# EAGLE design mega128board (EAGLE 6.1)
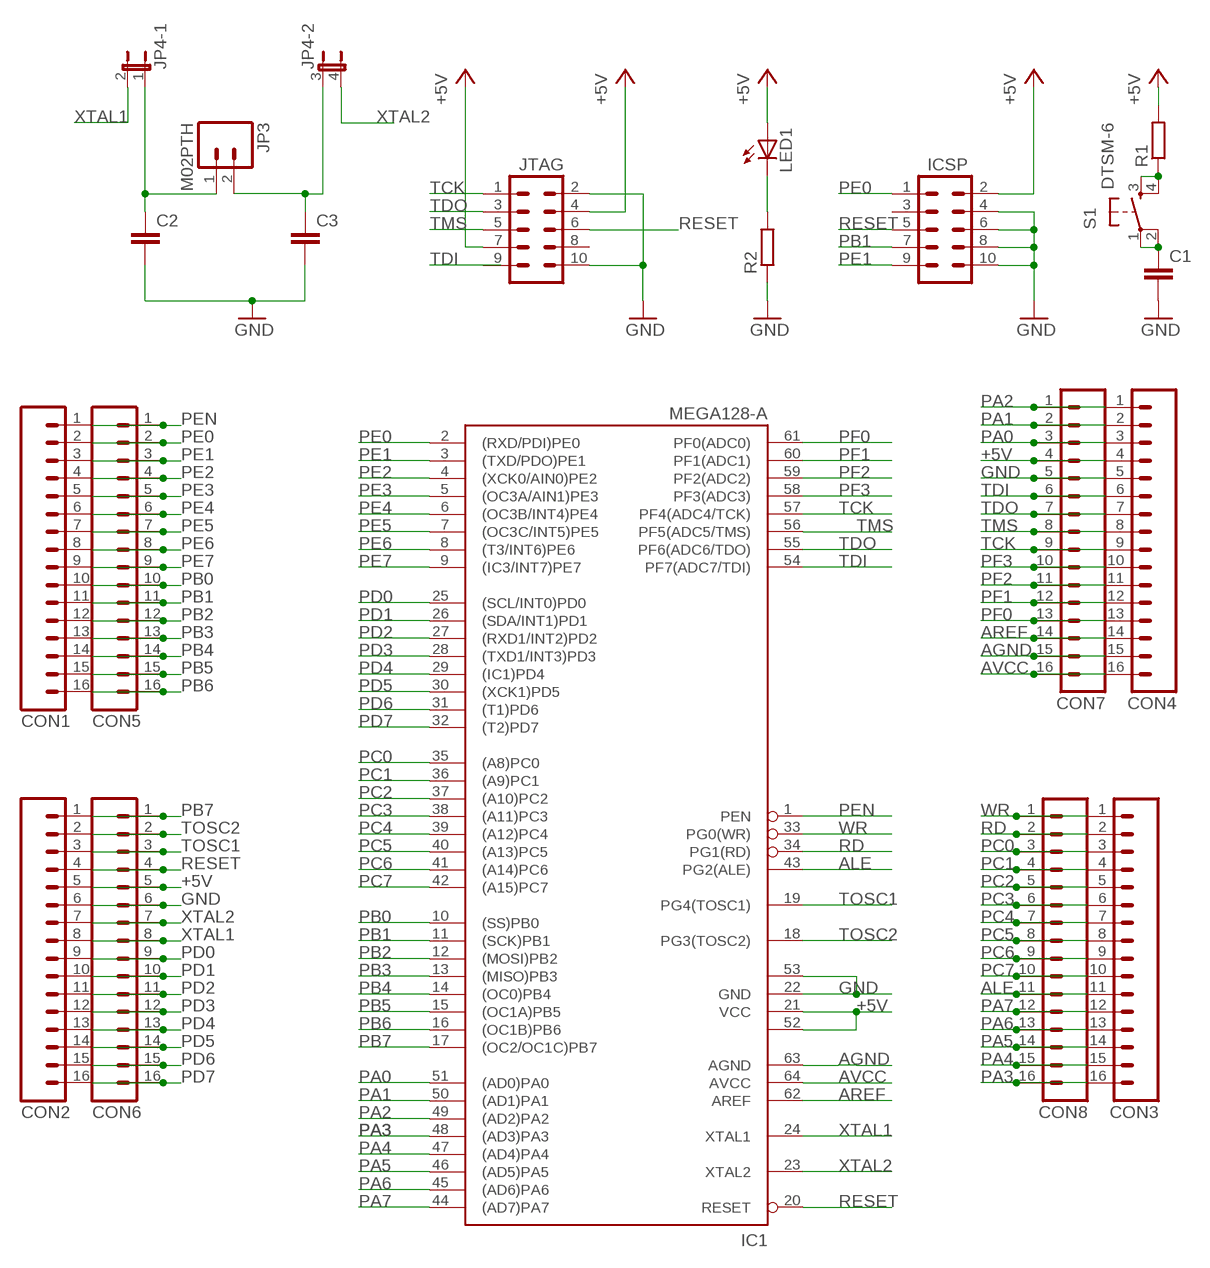
[diagram p0: schematic, sheet 1]

## Parts
C1  C-EUC0805  [C0805]
C2  C-EUC0805  [C0805]
C3  C-EUC0805  [C0805]
CON1  M161X16_NO_SILK  [1X16_NO_SILK]
CON2  M161X16_NO_SILK  [1X16_NO_SILK]
CON3  M161X16_NO_SILK  [1X16_NO_SILK]
CON4  M161X16_NO_SILK  [1X16_NO_SILK]
CON5  M161X16_NO_SILK  [1X16_NO_SILK]
CON6  M161X16_NO_SILK  [1X16_NO_SILK]
CON7  M161X16_NO_SILK  [1X16_NO_SILK]
CON8  M161X16_NO_SILK  [1X16_NO_SILK]
IC1  MEGA128-A  [TQFP64]
ICSP  M05X2SHD  [2X5-SHROUDED]
JP3  M02PTH  [1X02]
JP4  JP2QE  [JP2Q]
JTAG  M05X2SHD  [2X5-SHROUDED]
LED1  LED1206  [LED-1206]
R1  R-EU_M0805  [M0805]
R2  R-EU_M0805  [M0805]
S1  DTSM-6  [DTSM-6]

## Nets
+5V: CON2.5 CON4.4 CON6.5 CON7.4 IC1.21(VCC) IC1.52(VCC1) ICSP.2 JTAG.4 JTAG.7 LED1.A R1.2
AGND: CON4.15 CON7.15 IC1.63(AGND)
ALE: CON3.11 CON8.11 IC1.43(PG2(ALE))
AREF: CON4.14 CON7.14 IC1.62(AREF)
AVCC: CON4.16 CON7.16 IC1.64(AVCC)
GND: C1.2 C2.2 C3.2 CON2.6 CON4.5 CON6.6 CON7.5 IC1.22(GND) IC1.53(GND1) ICSP.4 ICSP.6 ICSP.8 ICSP.10 JTAG.2 JTAG.10 R2.1
N$1: C1.1 S1.1 S1.2
N$2: R1.1 S1.3 S1.4
N$3: LED1.C R2.2
N$5: C3.1 JP3.2 JP4.3
N$6: C2.1 JP3.1 JP4.1
PA0: CON4.3 CON7.3 IC1.51((AD0)PA0)
PA1: CON4.2 CON7.2 IC1.50((AD1)PA1)
PA2: CON4.1 CON7.1 IC1.49((AD2)PA2)
PA3: CON3.16 CON8.16 IC1.48((AD3)PA3)
PA4: CON3.15 CON8.15 IC1.47((AD4)PA4)
PA5: CON3.14 CON8.14 IC1.46((AD5)PA5)
PA6: CON3.13 CON8.13 IC1.45((AD6)PA6)
PA7: CON3.12 CON8.12 IC1.44((AD7)PA7)
PB0: CON1.10 CON5.10 IC1.10((SS)PB0)
PB1: CON1.11 CON5.11 IC1.11((SCK)PB1) ICSP.7
PB2: CON1.12 CON5.12 IC1.12((MOSI)PB2)
PB3: CON1.13 CON5.13 IC1.13((MISO)PB3)
PB4: CON1.14 CON5.14 IC1.14((OC0)PB4)
PB5: CON1.15 CON5.15 IC1.15((OC1A)PB5)
PB6: CON1.16 CON5.16 IC1.16((OC1B)PB6)
PB7: CON2.1 CON6.1 IC1.17((OC2/OC1C)PB7)
PC0: CON3.3 CON8.3 IC1.35((A8)PC0)
PC1: CON3.4 CON8.4 IC1.36((A9)PC1)
PC2: CON3.5 CON8.5 IC1.37((A10)PC2)
PC3: CON3.6 CON8.6 IC1.38((A11)PC3)
PC4: CON3.7 CON8.7 IC1.39((A12)PC4)
PC5: CON3.8 CON8.8 IC1.40((A13)PC5)
PC6: CON3.9 CON8.9 IC1.41((A14)PC6)
PC7: CON3.10 CON8.10 IC1.42((A15)PC7)
PD0: CON2.9 CON6.9 IC1.25((SCL/INT0)PD0)
PD1: CON2.10 CON6.10 IC1.26((SDA/INT1)PD1)
PD2: CON2.11 CON6.11 IC1.27((RXD1/INT2)PD2)
PD3: CON2.12 CON6.12 IC1.28((TXD1/INT3)PD3)
PD4: CON2.13 CON6.13 IC1.29((IC1)PD4)
PD5: CON2.14 CON6.14 IC1.30((XCK1)PD5)
PD6: CON2.15 CON6.15 IC1.31((T1)PD6)
PD7: CON2.16 CON6.16 IC1.32((T2)PD7)
PE0: CON1.2 CON5.2 IC1.2((RXD/PDI)PE0) ICSP.1
PE1: CON1.3 CON5.3 IC1.3((TXD/PDO)PE1) ICSP.9
PE2: CON1.4 CON5.4 IC1.4((XCK0/AIN0)PE2)
PE3: CON1.5 CON5.5 IC1.5((OC3A/AIN1)PE3)
PE4: CON1.6 CON5.6 IC1.6((OC3B/INT4)PE4)
PE5: CON1.7 CON5.7 IC1.7((OC3C/INT5)PE5)
PE6: CON1.8 CON5.8 IC1.8((T3/INT6)PE6)
PE7: CON1.9 CON5.9 IC1.9((IC3/INT7)PE7)
PEN: CON1.1 CON5.1 IC1.1(PEN)
PF0: CON4.13 CON7.13 IC1.61(PF0(ADC0))
PF1: CON4.12 CON7.12 IC1.60(PF1(ADC1))
PF2: CON4.11 CON7.11 IC1.59(PF2(ADC2))
PF3: CON4.10 CON7.10 IC1.58(PF3(ADC3))
RD: CON3.2 CON8.2 IC1.34(PG1(RD))
RESET: CON2.4 CON6.4 IC1.20(RESET) ICSP.5 JTAG.6
TCK: CON4.9 CON7.9 IC1.57(PF4(ADC4/TCK)) JTAG.1
TDI: CON4.6 CON7.6 IC1.54(PF7(ADC7/TDI))
TDO: CON4.7 CON7.7 IC1.55(PF6(ADC6/TDO)) JTAG.3
TMS: CON4.8 CON7.8 IC1.56(PF5(ADC5/TMS)) JTAG.5
TOSC1: CON2.3 CON6.3 IC1.19(PG4(TOSC1))
TOSC2: CON2.2 CON6.2 IC1.18(PG3(TOSC2))
WR: CON3.1 CON8.1 IC1.33(PG0(WR))
XTAL1: CON2.8 CON6.8 IC1.24(XTAL1) JP4.2
XTAL2: CON2.7 CON6.7 IC1.23(XTAL2) JP4.4
Unconnected: ICSP.3 JTAG.8 JTAG.9

## Library data of the parts
C1-C3 = rcl:C-EU: CAPACITOR, European symbol
CON1-CON8 = SparkFun-Connectors:M16: 1x16 .1" header
IC1 = avr-6:MEGA128: MICROCONTROLLER 128 Kbytes FLASH 4 Kbytes SRAM 4 Kbytes EEPROM DUAL USART 8-channel 10 bit ADC
ICSP JTAG = SparkFun-Connectors:M05X2: Header 5x2 Standard 10-pin dual row 0.1" header. Commonly used with AVR-ISP. Use with Spark Fun Electronics SKU: PRT-00778
JP3 = SparkFun-Connectors:M02: Standard 2-pin 0.1" header. Use with - straight break away headers ( PRT-00116) - right angle break away headers (PRT-00553) - swiss pins (PRT-00743) - machine pins (PRT-00117) - female headers (PRT-00115) Molex polarized connector foot print use with: PRT-08233 with associated crimp pins and housings. 2.54_SCREWTERM for use with PRT-10571. 3.5mm Screw Terminal footprints for PRT-08084 5mm Screw Terminal footprints for use with PRT-08433
JP4 = jumper:JP2QE: JUMPER
LED1 = SparkFun-LED:LED: LEDs Standard schematic elements and footprints for 5mm, 3mm, 1206, and 0603 sized LEDs. 5mm - Spark Fun Electronics SKU : COM-00529 (and others)
R1 R2 = rcl:R-EU_: RESISTOR, European symbol
S1 = switch-tact:DTSM-6

## Board
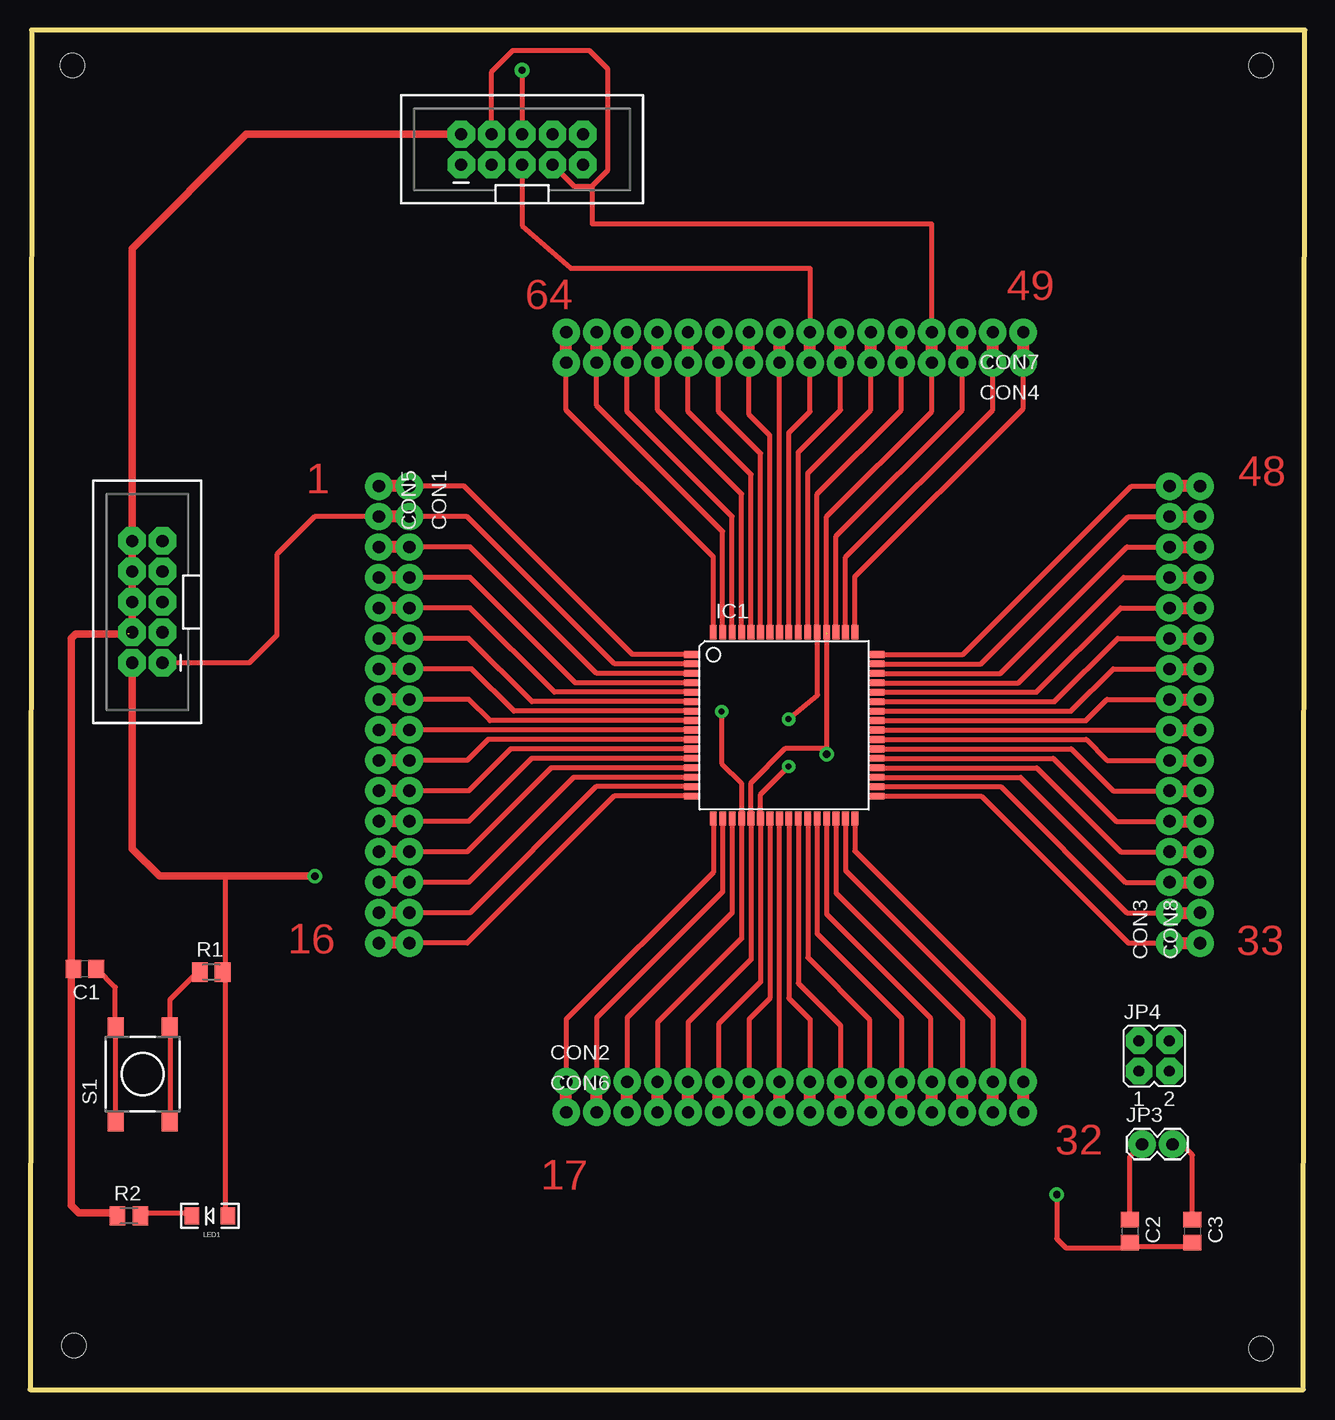
[diagram p1: board, top side]
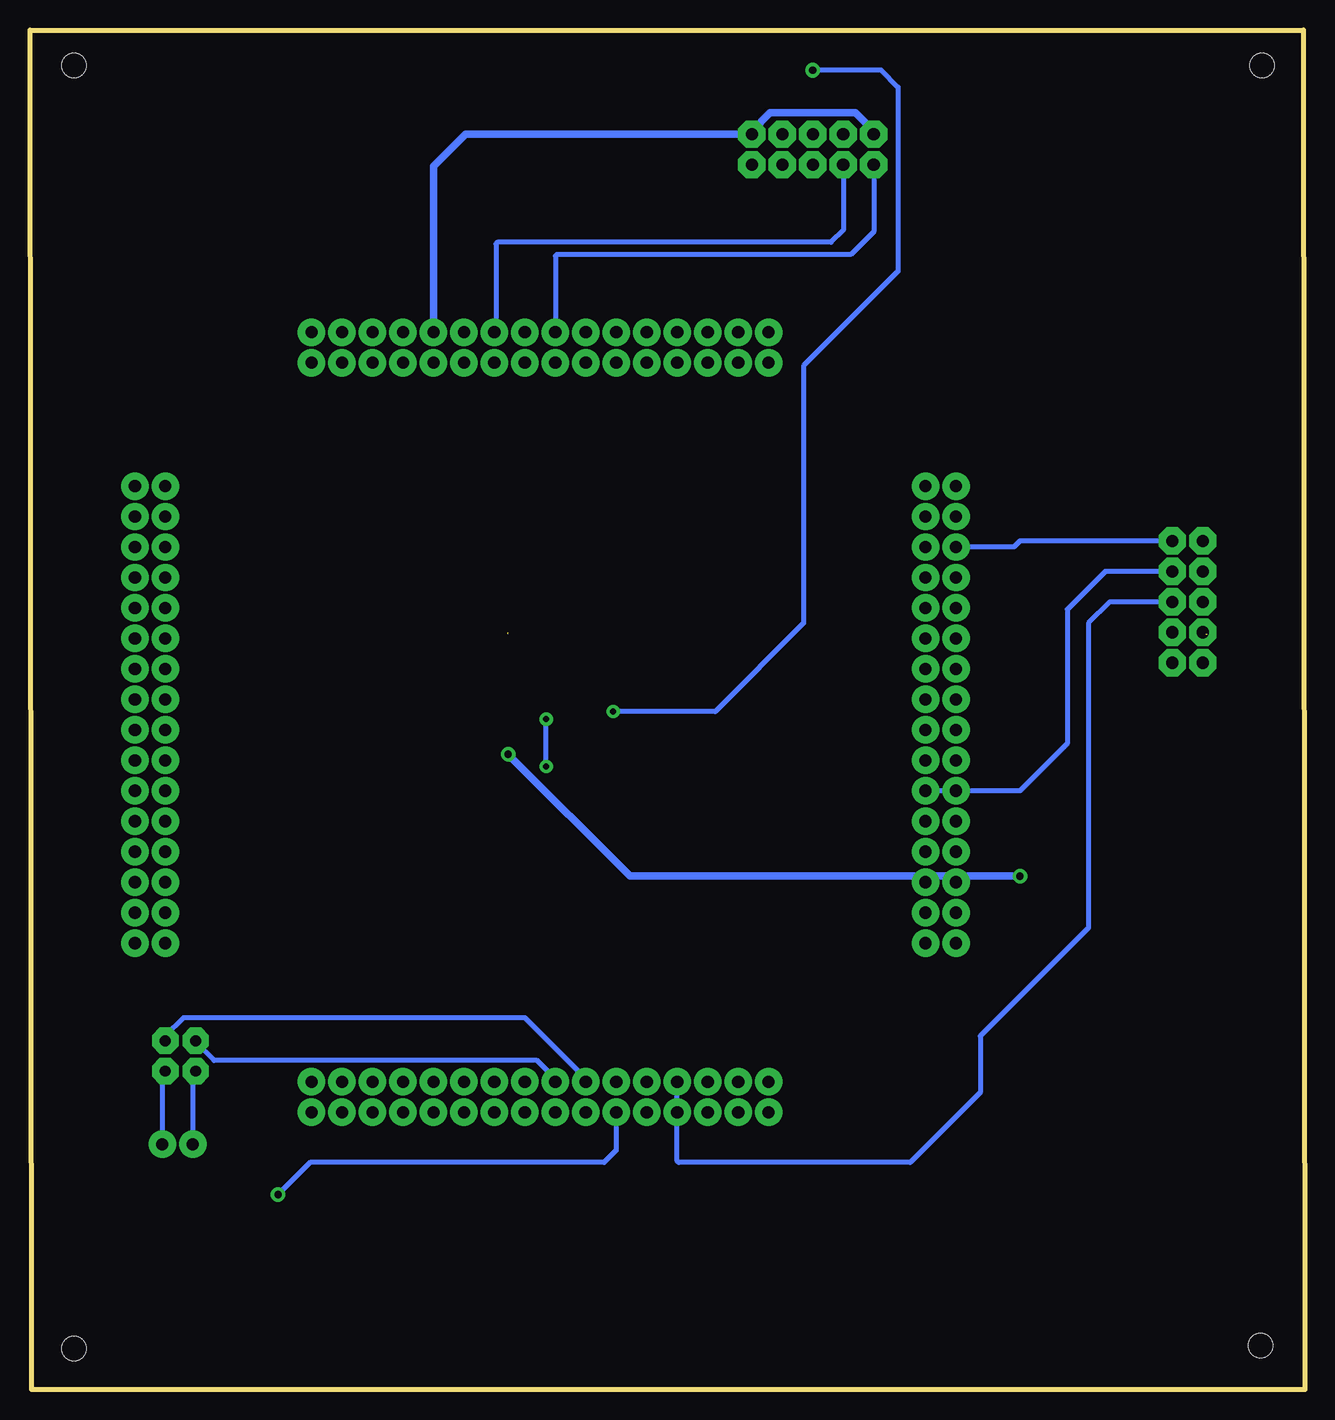
[diagram p2: board, bottom side, seen from below]

Size 106.28 x 113.33 mm. Coordinates in mm from the lower left corner, seen from the top.
Outline: 0,0 106.15,0 106.28,113.33 0.13,113.33 0,0
Copper layers (1*16): Top 0.035mm / dielectric 1.5mm / Bottom 0.035mm
Design rules: minimum track width 16mil, minimum drill 24mil, track to track 12mil, track to pad 12mil, pad to pad 12mil, via to via 12mil, smd to smd 8mil, copper to edge 40mil, drill to drill 40mil, minimum pad ring 25mil, minimum via ring 12mil, stop-mask expansion 4mil, vias tented up to drill 0mil, thermal gap 10mil
Holes 2.03 mm at 3.68,3.68 102.62,3.43 102.62,110.36 3.56,110.36

### Footprints (pad centres in the part's own frame; a part is rotated, then mirrored left to right if it is on the bottom)
C0805 = smd 1.3 x 1.5: 1 -0.95,0; 2 0.95,0
1X16_NO_SILK = drill 1.016 pad 1.88: 1 0,0; 2 2.54,0; 3 5.08,0; 4 7.62,0; 5 10.16,0; 6 12.7,0; 7 15.24,0; 8 17.78,0; 9 20.32,0; 10 22.86,0; 11 25.4,0; 12 27.94,0; 13 30.48,0; 14 33.02,0; 15 35.56,0; 16 38.1,0
TQFP64 = smd 1.194 x 0.559: 1 -7.76,5.905; 2 -7.76,5.118; 3 -7.76,4.331; 4 -7.76,3.543; 5 -7.76,2.756; 6 -7.76,1.968; 7 -7.76,1.181; 8 -7.76,0.394; 9 -7.76,-0.394; 10 -7.76,-1.181; 11 -7.76,-1.968; 12 -7.76,-2.756; 13 -7.76,-3.543; 14 -7.76,-4.331; 15 -7.76,-5.118; 16 -7.76,-5.905; 33 7.76,-5.905; 34 7.76,-5.118; 35 7.76,-4.331; 36 7.76,-3.543; 37 7.76,-2.756; 38 7.76,-1.968; 39 7.76,-1.181; 40 7.76,-0.394; 41 7.76,0.394; 42 7.76,1.181; 43 7.76,1.968; 44 7.76,2.756; 45 7.76,3.543; 46 7.76,4.331; 47 7.76,5.118; 48 7.76,5.905 | smd 0.559 x 1.194: 17 -5.905,-7.76; 18 -5.118,-7.76; 19 -4.331,-7.76; 20 -3.543,-7.76; 21 -2.756,-7.76; 22 -1.968,-7.76; 23 -1.181,-7.76; 24 -0.394,-7.76; 25 0.394,-7.76; 26 1.181,-7.76; 27 1.968,-7.76; 28 2.756,-7.76; 29 3.543,-7.76; 30 4.331,-7.76; 31 5.118,-7.76; 32 5.905,-7.76; 49 5.905,7.76; 50 5.118,7.76; 51 4.331,7.76; 52 3.543,7.76; 53 2.756,7.76; 54 1.968,7.76; 55 1.181,7.76; 56 0.394,7.76; 57 -0.394,7.76; 58 -1.181,7.76; 59 -1.968,7.76; 60 -2.756,7.76; 61 -3.543,7.76; 62 -4.331,7.76; 63 -5.118,7.76; 64 -5.905,7.76
2X5-SHROUDED = drill 1.016 pad 1.88 octagon: 1 -1.27,5.08; 2 1.27,5.08; 3 -1.27,2.54; 4 1.27,2.54; 5 -1.27,0; 6 1.27,0; 7 -1.27,-2.54; 8 1.27,-2.54; 9 -1.27,-5.08; 10 1.27,-5.08
1X02 = drill 1.016 pad 1.88: 1 0,0; 2 2.54,0
JP2Q = drill 0.914 octagon: 1 -1.27,-1.27; 2 -1.27,1.27; 3 1.27,-1.27; 4 1.27,1.27
LED-1206 = smd 1.2 x 1.4: A -1.5,0; C 1.5,0
M0805 = smd 1.3 x 1.6: 1 -0.95,0; 2 0.95,0
DTSM-6 = smd 1.55 x 1.3: 1 -3.975,2.25; 2 3.975,2.25; 3 -3.975,-2.25; 4 3.975,-2.25

### Placement (x,y rotation side)
C1  4.57,35.05 180 top
C2  91.69,13.21 270 top
C3  96.9,13.21 270 top
CON1  31.62,75.31 270 top
CON2  44.7,25.65 0 top
CON3  95,37.21 90 top
CON4  82.8,85.6 180 top
CON5  29.08,75.31 270 top
CON6  44.7,23.11 0 top
CON7  82.8,88.14 180 top
CON8  97.54,37.21 90 top
IC1  62.87,55.37 0 top
ICSP  9.78,65.66 180 top
JP3  92.71,20.45 0 top
JP4  93.73,27.81 0 top
JTAG  41.02,103.38 90 top
LED1  14.99,14.48 180 top
R1  15.11,34.8 0 top
R2  8.26,14.48 0 top
S1  9.4,26.29 90 top

### Tracks (layer width: path | path; a pad name or v marks a point on that pad's centre or on a via)
+5V  (via drill 0.6)  (1 unrouted)
  Top 0.406: CON2.5 54.86,30.61 60.11,35.85 IC1.21 60.11,50.58 62.99,53.47 65.91,53.47 | 46.86,100.33 45.34,100.33 JTAG.7 | CON7.4 75.18,97.16 46.86,97.16 46.86,100.33 | 46.86,100.33 48.13,101.6 48.13,110.11 46.61,111.63 40.26,111.63 38.48,109.86 JTAG.4 | 66.42,63.12 IC1.52 66.41,72.76 75.18,81.53 CON4.4 | 65.91,53.47 v66.42,52.96 | LED1.A 16.26,14.73 16.26,34.54 R1.2 16.26,35.05 16.26,42.8 | 65.91,53.47 66.42,53.47 66.42,62.99
  Top 0.61: ICSP.2 8.51,45.09 10.79,42.8 16.26,42.8 v23.75,42.8
  Top 1.016: CON6.5 CON2.5 | CON4.4 CON7.4
  Bottom 0.61: v23.75,42.8 56.26,42.8 v66.42,52.96
AGND
  Top 0.406: IC1.63 57.75,71.54 47.24,82.04 CON4.15
  Top 1.016: CON4.15 CON7.15
ALE
  Top 0.406: IC1.43 85.41,57.34 90.68,62.61 CON3.11
  Top 1.016: CON3.11 CON8.11
AREF
  Top 0.406: IC1.62 58.53,72.78 49.78,81.53 CON4.14
  Top 1.016: CON4.14 CON7.14
AVCC
  Top 0.406: IC1.64 56.96,69.41 44.7,81.66 CON4.16
  Top 1.016: CON4.16 CON7.16
GND  (via drill 0.5, 0.6)  (1 unrouted)
  Top 0.406: CON2.6 57.4,30.48 60.9,33.97 IC1.22 60.9,49.59 v63.25,51.94 | v63.25,55.88 65.66,57.91 65.66,63.09 IC1.53 65.62,74.64 72.64,81.66 CON4.5 | C3.2 96.52,12.7 96.52,12.57 | 8.13,62.99 ICSP.4 | v85.6,16.26 85.6,12.57 86.36,11.81 91.25,11.81 C2.2 91.95,12.7 91.95,12.06 92.08,11.94 96.52,11.94 96.77,12.19 96.77,12.32 96.52,12.57 | 96.52,12.57 96.65,12.57 97.16,12.06 | 7.11,14.73 R2.1 7.05,14.73 | 3.94,35.05 C1.2 | 3.43,35.18 3.94,35.05 | 3.94,35.05 3.43,34.54 | 8.26,62.99 8.38,63.12
  Top 0.61: JTAG.2 18.03,104.65 8.51,95.12 ICSP.10 ICSP.8 ICSP.6 ICSP.4 | 3.43,35.18 3.43,62.61 3.81,62.99 8.26,62.99 | 7.05,14.73 4.06,14.73 3.43,15.37 3.43,34.54
  Top 1.016: CON6.6 CON2.6 | CON4.5 CON7.5 72.64,88.27
  Bottom 0.406: 35.94,104.9 JTAG.2 | 46.1,104.9 JTAG.10 | v63.25,51.94 v63.25,55.88 | CON6.6 57.4,19.94 58.42,18.92 82.93,18.92 v85.6,16.26
  Bottom 0.61: 35.94,104.9 37.47,106.43 44.58,106.43 46.1,104.9 | JTAG.10 69.98,104.65 72.64,101.98 CON7.5
N$1
  Top 0.406: C1.1 5.59,35.05 7.11,33.53 7.11,30.48 S1.2 7.11,29.97 7.11,22.35 S1.1
N$2
  Top 0.406: S1.3 11.68,22.35 11.68,29.97 S1.4 11.68,30.48 11.68,32.51 13.72,34.54 R1.1
N$3
  Top 0.406: LED1.C 13.21,14.73 9.65,14.73 R2.2
N$5
  Top 0.406: C3.1 96.9,19.56 96.01,20.45 JP3.2
  Bottom 0.406: JP4.3 95.25,26.54 JP3.2
N$6
  Top 0.406: C2.1 91.69,19.43 JP3.1
  Bottom 0.406: JP4.1 92.71,26.54 JP3.1
PA0
  Top 0.406: IC1.51 67.2,71.13 77.72,81.66 CON4.3
  Top 1.016: CON4.3 CON7.3
PA1
  Top 0.406: IC1.50 67.98,69.38 80.26,81.66 CON4.2
  Top 1.016: CON4.2 CON7.2
PA2
  Top 0.406: IC1.49 68.77,67.75 82.8,81.79 CON4.1
  Top 1.016: CON4.1 CON7.1
PA3
  Top 0.406: IC1.48 77.79,61.28 91.82,75.31 CON3.16
  Top 1.016: CON8.16 CON3.16
PA4
  Top 0.406: IC1.47 79.29,60.49 91.57,72.77 CON3.15
  Top 1.016: CON3.15 CON8.15
PA5
  Top 0.406: IC1.46 80.91,59.7 91.44,70.23 CON3.14
  Top 1.016: CON3.14 CON8.14
PA6
  Top 0.406: IC1.45 82.41,58.91 91.19,67.69 CON3.13
  Top 1.016: CON3.13 CON8.13
PA7
  Top 0.406: IC1.44 83.91,58.13 90.93,65.15 CON3.12
  Top 1.016: CON3.12 CON8.12
PB0
  Top 0.406: IC1.10 38.19,54.19 36.45,52.45 CON1.10
  Top 1.016: CON1.10 CON5.10
PB1
  Top 0.406: IC1.11 40.07,53.4 36.58,49.91 CON1.11
  Top 1.016: CON1.11 CON5.11
  Bottom 0.406: ICSP.7 16.64,68.2 19.81,65.02 19.81,53.85 23.75,49.91 CON1.11
PB2
  Top 0.406: IC1.12 41.82,52.62 36.58,47.37 CON1.12
  Top 1.016: CON1.12 CON5.12
PB3
  Top 0.406: IC1.13 43.45,51.83 36.45,44.83 CON1.13
  Top 1.016: CON1.13 CON5.13
PB4
  Top 0.406: IC1.14 45.33,51.04 36.58,42.29 CON1.14
  Top 1.016: CON1.14 CON5.14
PB5
  Top 0.406: IC1.15 47.21,50.25 36.7,39.75 CON1.15
  Top 1.016: CON1.15 CON5.15
PB6
  Top 0.406: IC1.16 48.7,49.47 36.45,37.21 CON1.16
  Top 1.016: CON1.16 CON5.16
PB7
  Top 0.406: IC1.17 56.96,43.12 44.7,30.86 CON2.1 44.7,25.4
  Top 1.016: CON6.1 44.7,25.4 44.7,25.53
PC0
  Top 0.406: IC1.35 82.56,51.04 91.31,42.29 CON3.3
  Top 1.016: CON3.3 CON8.3
PC1
  Top 0.406: IC1.36 83.93,51.83 90.93,44.83 CON3.4
  Top 1.016: CON3.4 CON8.4
PC2
  Top 0.406: IC1.37 85.31,52.62 90.55,47.37 CON3.5
  Top 1.016: CON3.5 CON8.5
PC3
  Top 0.406: IC1.38 86.81,53.4 90.3,49.91 CON3.6
  Top 1.016: CON3.6 CON8.6
PC4
  Top 0.406: IC1.39 88.05,54.19 89.79,52.45 CON3.7
  Top 1.016: CON3.7 CON8.7
PC5
  Top 0.406: IC1.40 95,54.98 CON3.8
  Top 1.016: CON3.8 CON8.8
PC6
  Top 0.406: IC1.41 88.02,55.77 89.79,57.53 CON3.9
  Top 1.016: CON3.9 CON8.9
PC7
  Top 0.406: IC1.42 86.78,56.55 90.3,60.07 CON3.10
  Top 1.016: CON3.10 CON8.10
PD0
  Top 0.406: IC1.25 63.26,32.63 65.02,30.86 CON2.9
  Top 1.016: CON6.9 CON2.9
PD1
  Top 0.406: IC1.26 64.05,33.87 67.56,30.35 CON2.10
  Top 1.016: CON6.10 CON2.10
PD2
  Top 0.406: IC1.27 64.83,36.01 69.98,30.86 69.98,25.78 CON2.11
  Top 1.016: CON6.11 CON2.11
PD3
  Top 0.406: IC1.28 65.62,38.01 72.64,30.99 CON2.12
  Top 1.016: CON6.12 CON2.12
PD4
  Top 0.406: IC1.29 66.41,39.64 75.06,30.99 75.06,25.78 CON2.13
  Top 1.016: CON6.13 CON2.13
PD5
  Top 0.406: IC1.30 67.2,41.39 77.72,30.86 CON2.14
  Top 1.016: CON6.14 CON2.14
PD6
  Top 0.406: IC1.31 67.98,43.27 80.26,30.99 CON2.15
  Top 1.016: CON6.15 CON2.15
PD7
  Top 0.406: IC1.32 68.77,44.9 82.8,30.86 CON2.16
  Top 1.016: CON6.16 CON2.16
PE0
  Top 0.406: IC1.2 48.73,60.49 36.45,72.77 CON1.2 | CON5.2 23.75,72.77 20.57,69.6 20.57,62.87 18.29,60.58 ICSP.1
  Top 1.016: CON1.2 CON5.2
PE1
  Top 0.406: IC1.3 47.23,59.7 36.7,70.23 CON1.3
  Top 1.016: CON1.3 CON5.3
  Bottom 0.406: ICSP.9 23.75,70.74 24.26,70.23 CON5.3
PE2
  Top 0.406: IC1.4 45.48,58.91 36.7,67.69 CON1.4
  Top 1.016: CON1.4 CON5.4
PE3
  Top 0.406: IC1.5 43.73,58.13 36.7,65.15 CON1.5
  Top 1.016: CON1.5 CON5.5
PE4
  Top 0.406: IC1.6 41.85,57.34 36.58,62.61 CON1.6
  Top 1.016: CON1.6 CON5.6
PE5
  Top 0.406: IC1.7 40.35,56.55 36.83,60.07 CON1.7
  Top 1.016: CON1.7 CON5.7
PE6
  Top 0.406: IC1.8 38.34,55.77 36.58,57.53 CON1.8
  Top 1.016: CON1.8 CON5.8
PE7
  Top 0.406: IC1.9 55.09,54.99 CON1.9
  Top 1.016: CON1.9 CON5.9
PEN
  Top 0.406: IC1.1 50.23,61.28 36.2,75.31 CON1.1
  Top 1.016: CON1.1 CON5.1
PF0
  Top 0.406: IC1.61 59.32,74.66 52.32,81.66 CON4.13
  Top 1.016: CON4.13 CON7.13
PF1
  Top 0.406: IC1.60 60.11,76.29 54.86,81.53 CON4.12
  Top 1.016: CON4.12 CON7.12
PF2
  Top 0.406: IC1.59 60.9,78.04 57.4,81.53 CON4.11
  Top 1.016: CON4.11 CON7.11
PF3
  Top 0.406: IC1.58 61.68,79.54 59.94,81.28 CON4.10
  Top 1.016: CON4.10 CON7.10
RD
  Top 0.406: IC1.34 80.94,50.25 91.44,39.75 CON3.2
  Top 1.016: CON3.2 CON8.2
RESET  (via drill 0.5, 0.61)
  Top 0.406: CON2.4 52.32,30.61 59.32,37.6 IC1.20 59.31,47.62 59.31,50.55 57.66,52.2 v57.66,56.52 | v41.02,109.98 JTAG.6
  Top 1.016: CON6.4 CON2.4
  Bottom 0.406: v41.02,109.98 35.31,109.98 33.91,108.58 33.91,93.22 41.78,85.34 41.78,63.88 49.15,56.52 v57.66,56.52 57.91,56.39 57.78,56.39 57.66,56.26 | ICSP.5 16.26,65.66 18.03,63.88 18.03,38.48 27.05,29.46 27.05,24.77 32.89,18.92 52.2,18.92 52.32,19.05 CON2.4
TCK
  Top 0.406: 62.48,63.13 IC1.57 62.47,85.33 62.48,85.34
  Top 1.016: 62.48,85.34 CON4.9 CON7.9
  Bottom 0.406: JTAG.1 35.94,96.52 37.85,94.61 62.36,94.61 62.48,94.49 CON7.9
TDI
  Top 0.406: IC1.54 64.83,76.39 70.1,81.66 CON4.6
  Top 1.016: CON4.6 CON7.6
TDO
  Top 0.406: IC1.55 64.05,78.14 67.56,81.66 CON4.7
  Top 1.016: CON4.7 CON7.7
  Bottom 0.406: JTAG.3 38.48,96.65 39.5,95.63 67.31,95.63 67.44,95.5 67.44,88.39 | 67.44,88.39 67.44,88.27 | CON7.7 67.56,88.39 67.44,88.39
TMS
  Top 0.406: JTAG.5 41.02,97.03 45.09,93.47 65.02,93.47 CON7.8 | IC1.56 63.26,79.77 65.02,81.53 65.02,85.47
  Top 1.016: 65.02,85.47 CON4.8 CON7.8
TOSC1
  Top 0.406: IC1.19 58.53,39.74 49.78,30.99 CON2.3
  Top 1.016: CON6.3 CON2.3
TOSC2
  Top 0.406: IC1.18 57.75,41.49 47.24,30.99 CON2.2
  Top 1.016: CON6.2 CON2.2
WR
  Top 0.406: IC1.33 79.31,49.47 91.57,37.21 CON3.1
  Top 1.016: CON3.1 CON8.1
XTAL1
  Top 0.406: CON2.8 IC1.24
  Top 1.016: CON6.8 CON2.8
  Bottom 0.406: JP4.2 92.46,28.96 90.93,27.43 64.01,27.43 62.48,25.91 CON2.8
XTAL2
  Top 0.406: IC1.23 61.68,32.6 59.94,30.86 CON2.7
  Top 1.016: CON6.7 CON2.7
  Bottom 0.406: JP4.4 95,29.46 93.47,30.99 65.02,30.99 59.94,25.91 CON2.7

### Text on the board
Top: 49 | 64 | 1 | 48 | 16 | 33 | 32 | 17